# EasyEDA Pro project ProPrj_ESP32S2-Mini卡林巴17键音乐键盘_2025-05-19.epro

# Schematic Schematic2
Create Date: 2024-06-29; Page Name: P1; Project Name: 卡林巴17键模拟器; Schematic Name: Schematic2; Update Date: 2024-06-29
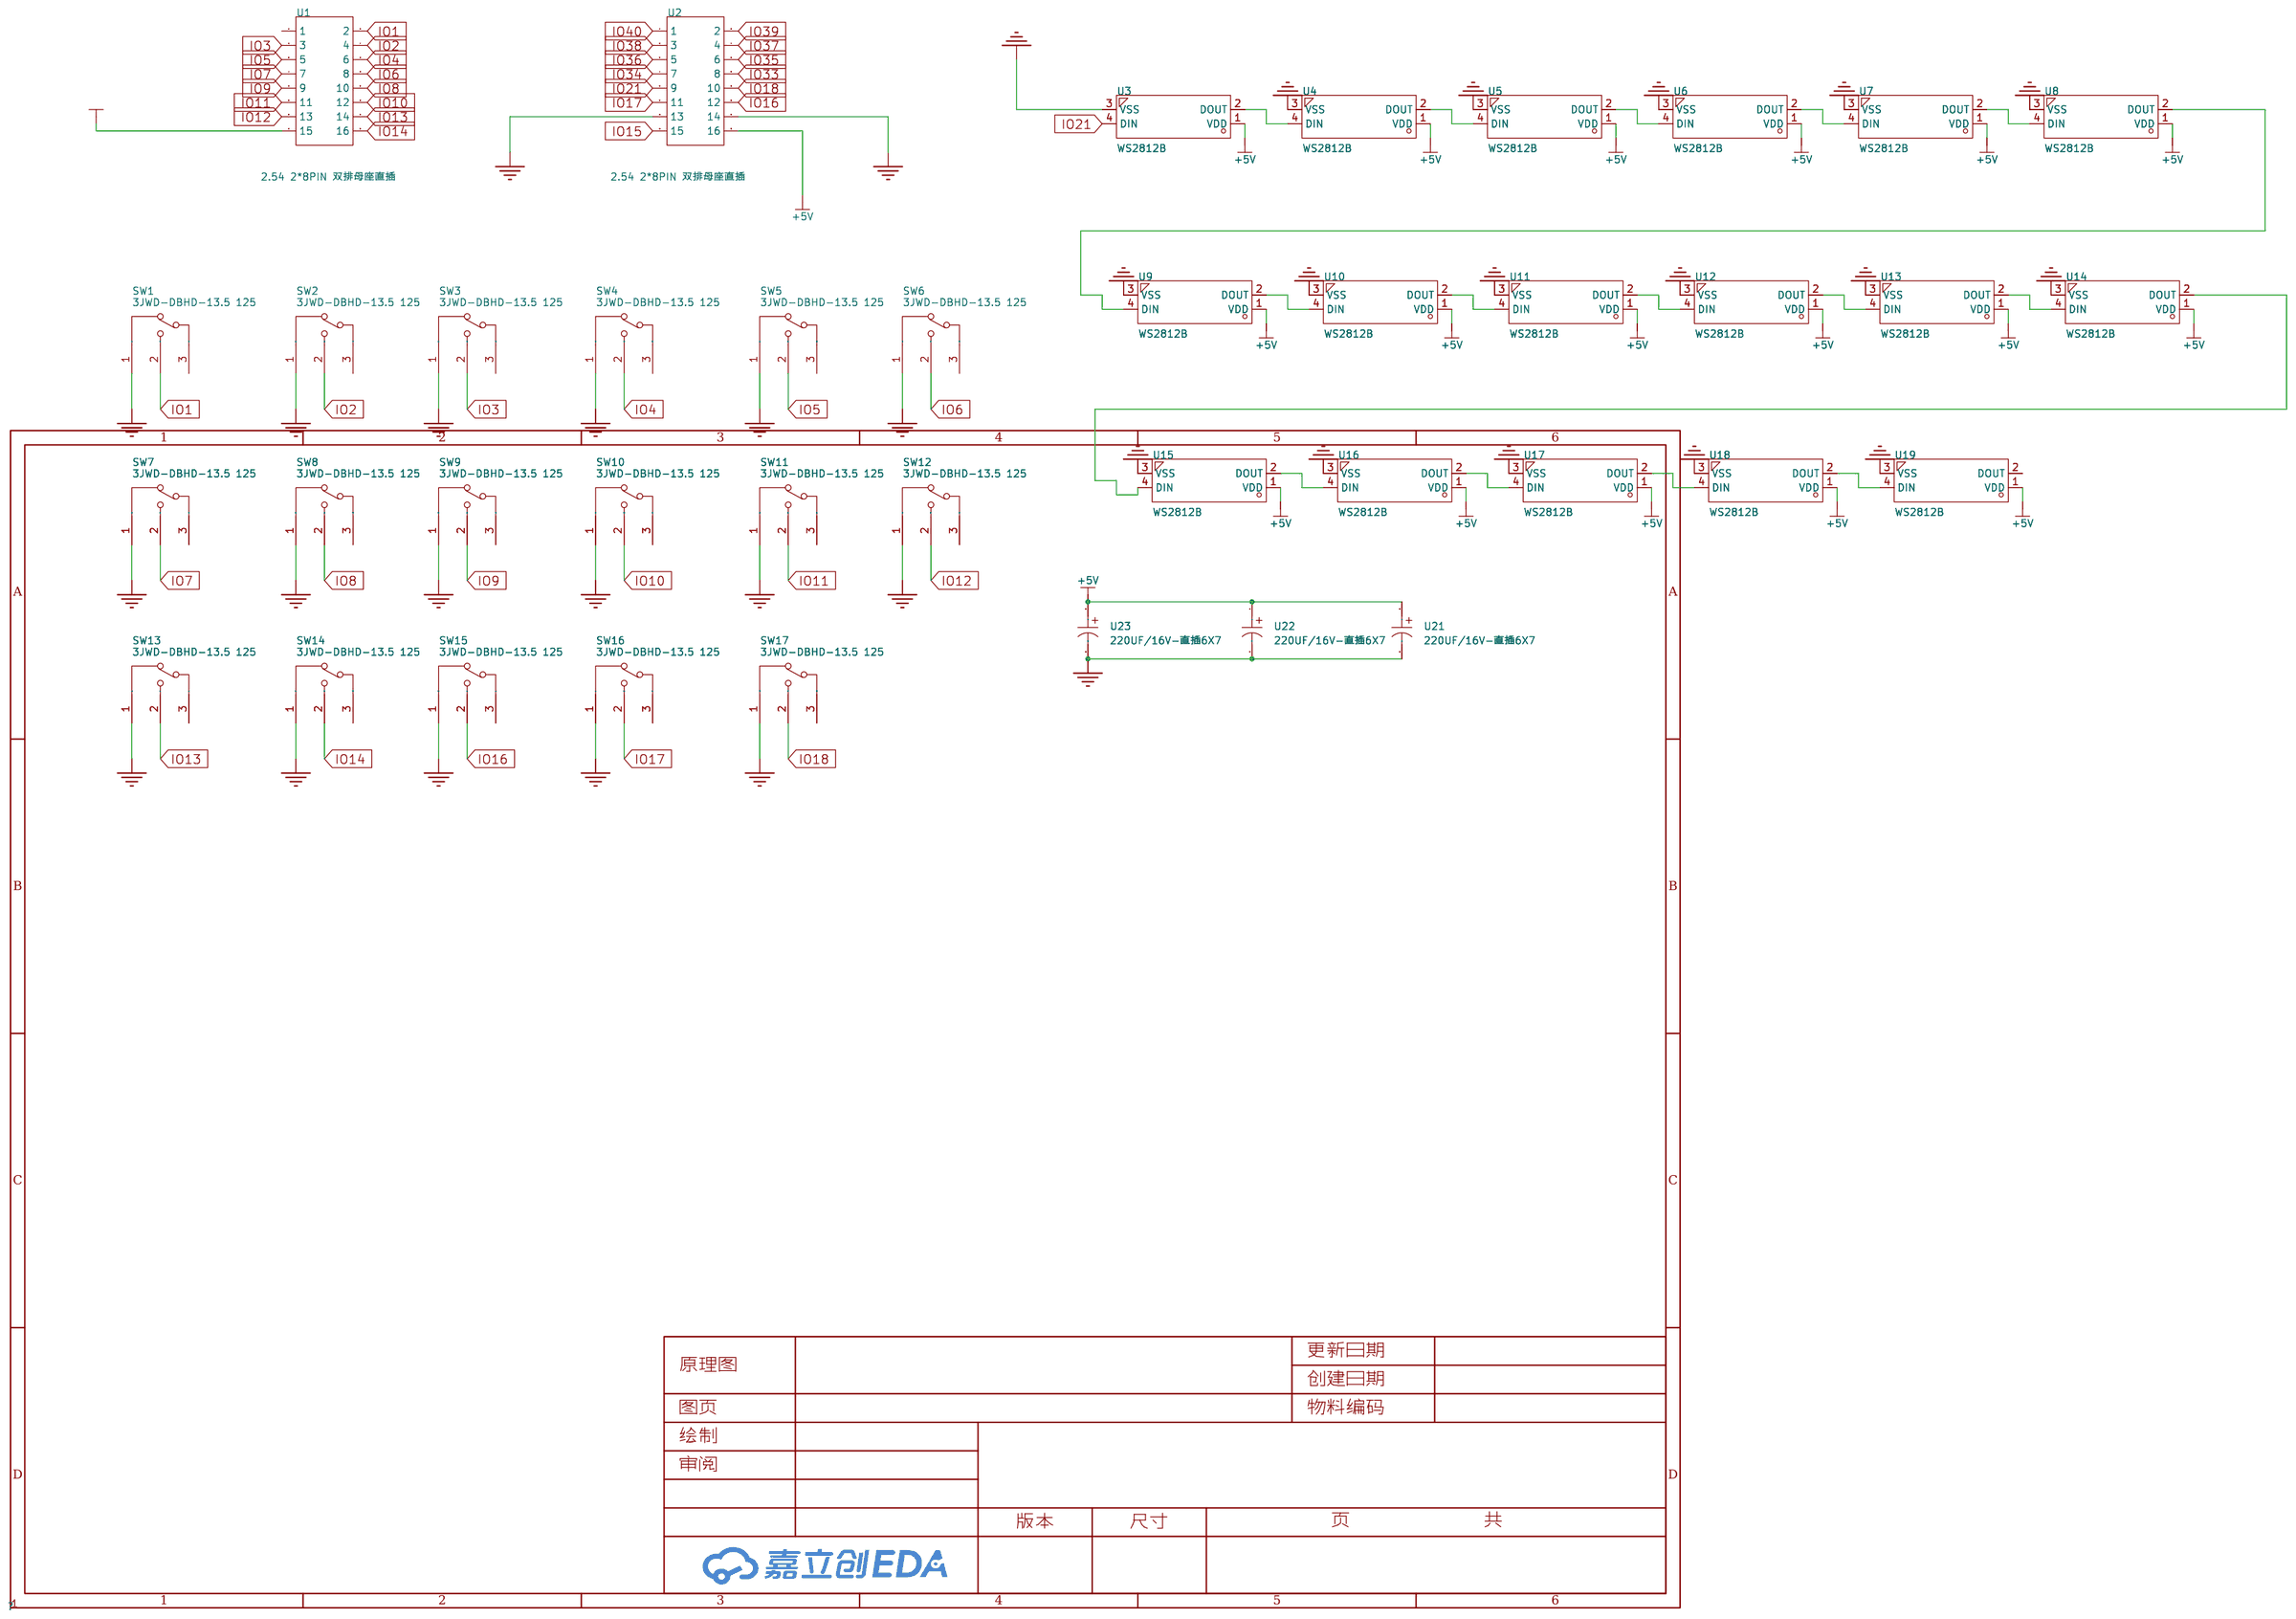
[diagram p0: schematic sheet]

## Parts
SW1  3JWD-DBHD-13.5 125  [SW-TH_SHOU-HAN_3JWD-DBHD-13.5]
SW2  3JWD-DBHD-13.5 125  [SW-TH_SHOU-HAN_3JWD-DBHD-13.5]
SW3  3JWD-DBHD-13.5 125  [SW-TH_SHOU-HAN_3JWD-DBHD-13.5]
SW4  3JWD-DBHD-13.5 125  [SW-TH_SHOU-HAN_3JWD-DBHD-13.5]
SW5  3JWD-DBHD-13.5 125  [SW-TH_SHOU-HAN_3JWD-DBHD-13.5]
SW6  3JWD-DBHD-13.5 125  [SW-TH_SHOU-HAN_3JWD-DBHD-13.5]
SW7  3JWD-DBHD-13.5 125  [SW-TH_SHOU-HAN_3JWD-DBHD-13.5]
SW8  3JWD-DBHD-13.5 125  [SW-TH_SHOU-HAN_3JWD-DBHD-13.5]
SW9  3JWD-DBHD-13.5 125  [SW-TH_SHOU-HAN_3JWD-DBHD-13.5]
SW10  3JWD-DBHD-13.5 125  [SW-TH_SHOU-HAN_3JWD-DBHD-13.5]
SW11  3JWD-DBHD-13.5 125  [SW-TH_SHOU-HAN_3JWD-DBHD-13.5]
SW12  3JWD-DBHD-13.5 125  [SW-TH_SHOU-HAN_3JWD-DBHD-13.5]
SW13  3JWD-DBHD-13.5 125  [SW-TH_SHOU-HAN_3JWD-DBHD-13.5]
SW14  3JWD-DBHD-13.5 125  [SW-TH_SHOU-HAN_3JWD-DBHD-13.5]
SW15  3JWD-DBHD-13.5 125  [SW-TH_SHOU-HAN_3JWD-DBHD-13.5]
SW16  3JWD-DBHD-13.5 125  [SW-TH_SHOU-HAN_3JWD-DBHD-13.5]
SW17  3JWD-DBHD-13.5 125  [SW-TH_SHOU-HAN_3JWD-DBHD-13.5]
U1  2.54 2*8PIN 双排母座直插  [HDR-TH_16P-P2.54-V-F-R2-C8-S2.54-1]
U2  2.54 2*8PIN 双排母座直插  [HDR-TH_16P-P2.54-V-F-R2-C8-S2.54-1]
U3  WS2812B  [LED-SMD_4P-L5.0-W5.0-TL]
U4  WS2812B  [LED-SMD_4P-L5.0-W5.0-TL]
U5  WS2812B  [LED-SMD_4P-L5.0-W5.0-TL]
U6  WS2812B  [LED-SMD_4P-L5.0-W5.0-TL]
U7  WS2812B  [LED-SMD_4P-L5.0-W5.0-TL]
U8  WS2812B  [LED-SMD_4P-L5.0-W5.0-TL]
U9  WS2812B  [LED-SMD_4P-L5.0-W5.0-TL]
U10  WS2812B  [LED-SMD_4P-L5.0-W5.0-TL]
U11  WS2812B  [LED-SMD_4P-L5.0-W5.0-TL]
U12  WS2812B  [LED-SMD_4P-L5.0-W5.0-TL]
U13  WS2812B  [LED-SMD_4P-L5.0-W5.0-TL]
U14  WS2812B  [LED-SMD_4P-L5.0-W5.0-TL]
U15  WS2812B  [LED-SMD_4P-L5.0-W5.0-TL]
U16  WS2812B  [LED-SMD_4P-L5.0-W5.0-TL]
U17  WS2812B  [LED-SMD_4P-L5.0-W5.0-TL]
U18  WS2812B  [LED-SMD_4P-L5.0-W5.0-TL]
U19  WS2812B  [LED-SMD_4P-L5.0-W5.0-TL]
U21  220UF/16V-直插6X7  [CAP-TH_BD6.3-P2.50-D0.5-FD]
U22  220UF/16V-直插6X7  [CAP-TH_BD6.3-P2.50-D0.5-FD]
U23  220UF/16V-直插6X7  [CAP-TH_BD6.3-P2.50-D0.5-FD]

## Library data of the parts
SW1-SW17 = 3JWD-DBHD-13.5 125: 鼠标开关 3脚微动开关 红点 柄长13.5mm; LCSC Part Name: 3脚鼠标ETC专用微动开关 1A 125V 带柄柄长13.5mm 红点; Supplier Part: C2906291; Manufacturer: SHOU HAN(首韩); Supplier Footprint: 插件; JLCPCB Part Class: 扩展库; Datasheet: https://atta.szlcsc.com/upload/public/pdf/source/20211019/52ACE125E0FDD69DD4046775F52831F0.pdf; Supplier: LCSC
U1 U2 = 2.54 2*8PIN 双排母座直插: Supplier Part: C9900000696; Supplier Footprint: TH-16_5.0X20.3X2.54P; JLCPCB Part Class: 扩展库; Supplier: LCSC
U3-U19 = WS2812B_1: Supplier Part: C9900106807; Supplier Footprint: SMD-LED-5328; JLCPCB Part Class: 扩展库; Supplier: LCSC
U21-U23 = 220UF/16V-直插6X7: Supplier Part: C9900012263; Supplier Footprint: CAP-TH; JLCPCB Part Class: 扩展库; Supplier: LCSC

## Nets
+5V: U2.16 U3.1(VDD) U4.1(VDD) U5.1(VDD) U6.1(VDD) U7.1(VDD) U8.1(VDD) U9.1(VDD) U10.1(VDD) U11.1(VDD) U12.1(VDD) U13.1(VDD) U14.1(VDD) U15.1(VDD) U16.1(VDD) U17.1(VDD) U18.1(VDD) U19.1(VDD) U21.1 U22.1 U23.1
GND: SW1.1(C) SW2.1(C) SW3.1(C) SW4.1(C) SW5.1(C) SW6.1(C) SW7.1(C) SW8.1(C) SW9.1(C) SW10.1(C) SW11.1(C) SW12.1(C) SW13.1(C) SW14.1(C) SW15.1(C) SW16.1(C) SW17.1(C) U2.13 U2.14 U3.3(VSS) U4.3(VSS) U5.3(VSS) U6.3(VSS) U7.3(VSS) U8.3(VSS) U9.3(VSS) U10.3(VSS) U11.3(VSS) U12.3(VSS) U13.3(VSS) U14.3(VSS) U15.3(VSS) U16.3(VSS) U17.3(VSS) U18.3(VSS) U19.3(VSS) U21.2 U22.2 U23.2
VCC3v3: U1.15
IO1: SW1.2(ON) U1.2
IO2: SW2.2(ON) U1.4
IO3: SW3.2(ON) U1.3
IO4: SW4.2(ON) U1.6
IO5: SW5.2(ON) U1.5
IO6: SW6.2(ON) U1.8
IO7: SW7.2(ON) U1.7
IO8: SW8.2(ON) U1.10
IO9: SW9.2(ON) U1.9
IO10: SW10.2(ON) U1.12
IO11: SW11.2(ON) U1.11
IO12: SW12.2(ON) U1.13
IO13: SW13.2(ON) U1.14
IO14: SW14.2(ON) U1.16
IO15: U2.15
IO16: SW15.2(ON) U2.12
IO17: SW16.2(ON) U2.11
IO18: SW17.2(ON) U2.10
IO21: U2.9 U3.4(DIN)
IO33: U2.8
IO34: U2.7
IO35: U2.6
IO36: U2.5
IO37: U2.4
IO38: U2.3
IO39: U2.2
IO40: U2.1
$1N2620: U3.2(DOUT) U4.4(DIN)
$1N2777: U4.2(DOUT) U5.4(DIN)
$1N2848: U5.2(DOUT) U6.4(DIN)
$1N2919: U6.2(DOUT) U7.4(DIN)
$1N2990: U7.2(DOUT) U8.4(DIN)
$1N3061: U8.2(DOUT) U9.4(DIN)
$1N3132: U9.2(DOUT) U10.4(DIN)
$1N3203: U10.2(DOUT) U11.4(DIN)
$1N3274: U11.2(DOUT) U12.4(DIN)
$1N3345: U12.2(DOUT) U13.4(DIN)
$1N3416: U13.2(DOUT) U14.4(DIN)
$1N3487: U14.2(DOUT) U15.4(DIN)
$1N3558: U15.2(DOUT) U16.4(DIN)
$1N3629: U16.2(DOUT) U17.4(DIN)
$1N3700: U17.2(DOUT) U18.4(DIN)
$1N3771: U18.2(DOUT) U19.4(DIN)

Not connected (* = marked no-connect by the designer): SW1 3(NC); SW2 3(NC); SW3 3(NC); SW4 3(NC); SW5 3(NC); SW6 3(NC); SW7 3(NC); SW8 3(NC); SW9 3(NC); SW10 3(NC); SW11 3(NC); SW12 3(NC); SW13 3(NC); SW14 3(NC); SW15 3(NC); SW16 3(NC); SW17 3(NC); U1 1; U19 2(DOUT)

# Board PCB6
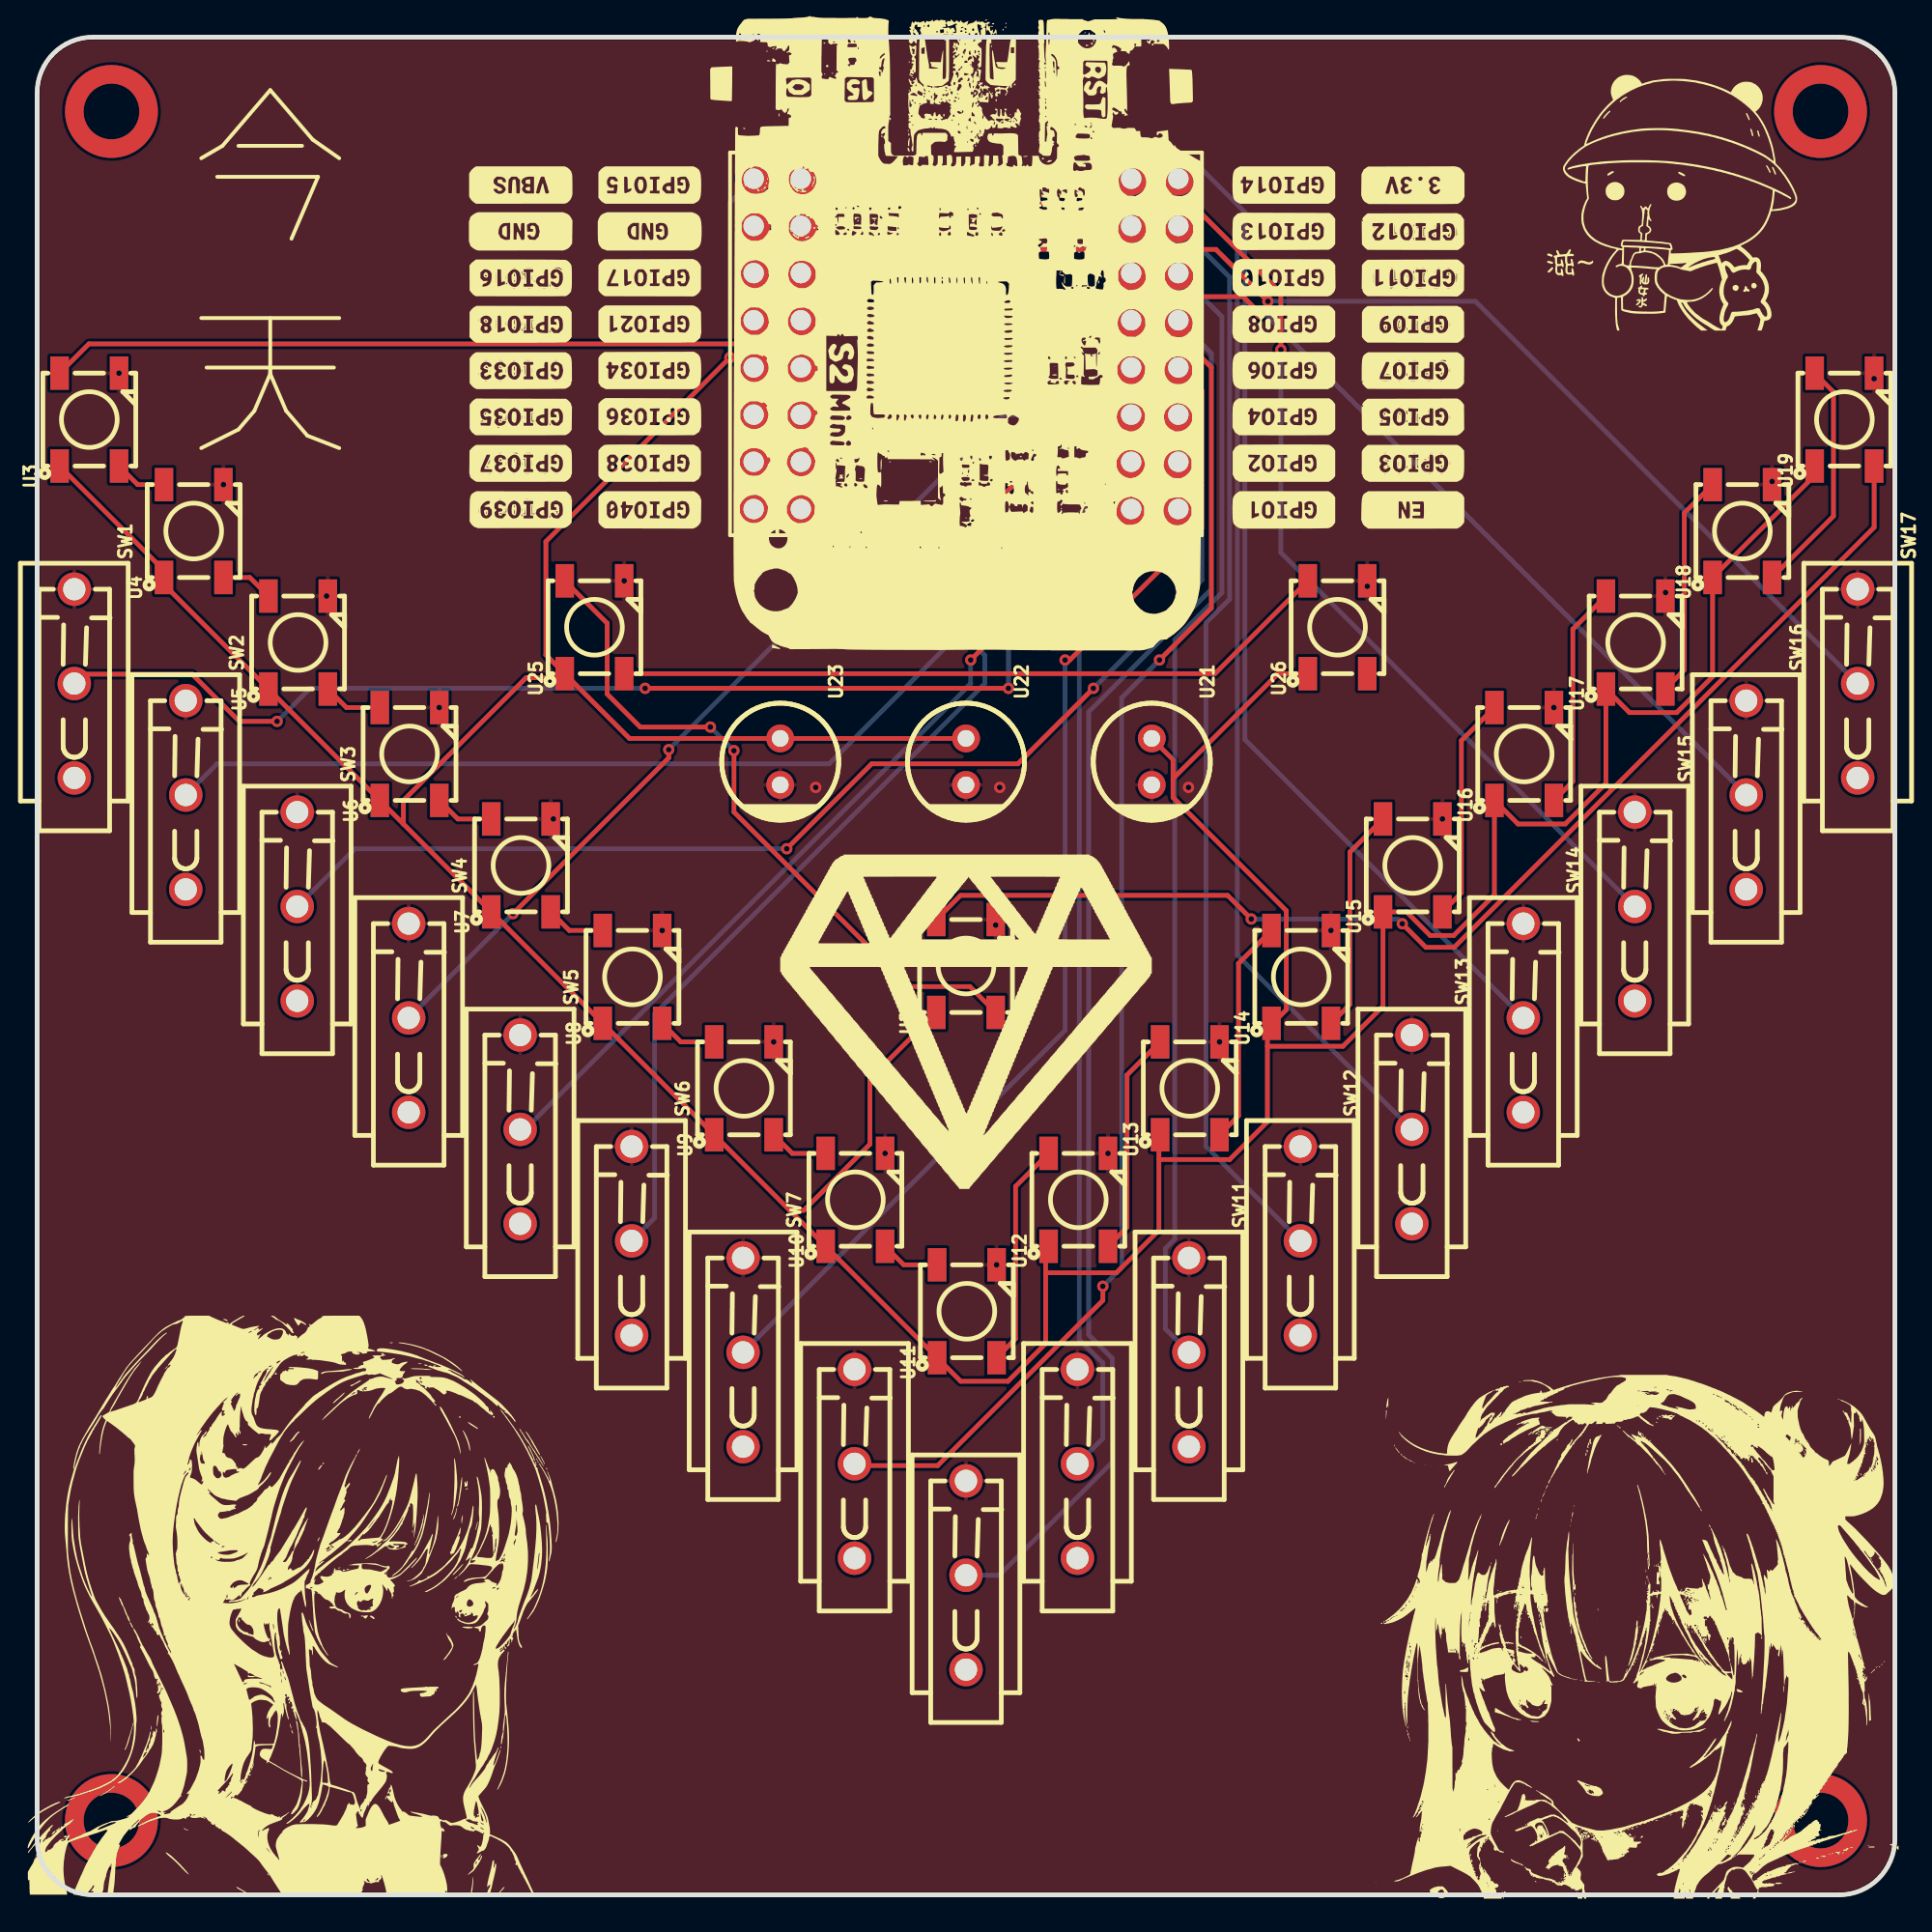
[diagram p1: board, top side]
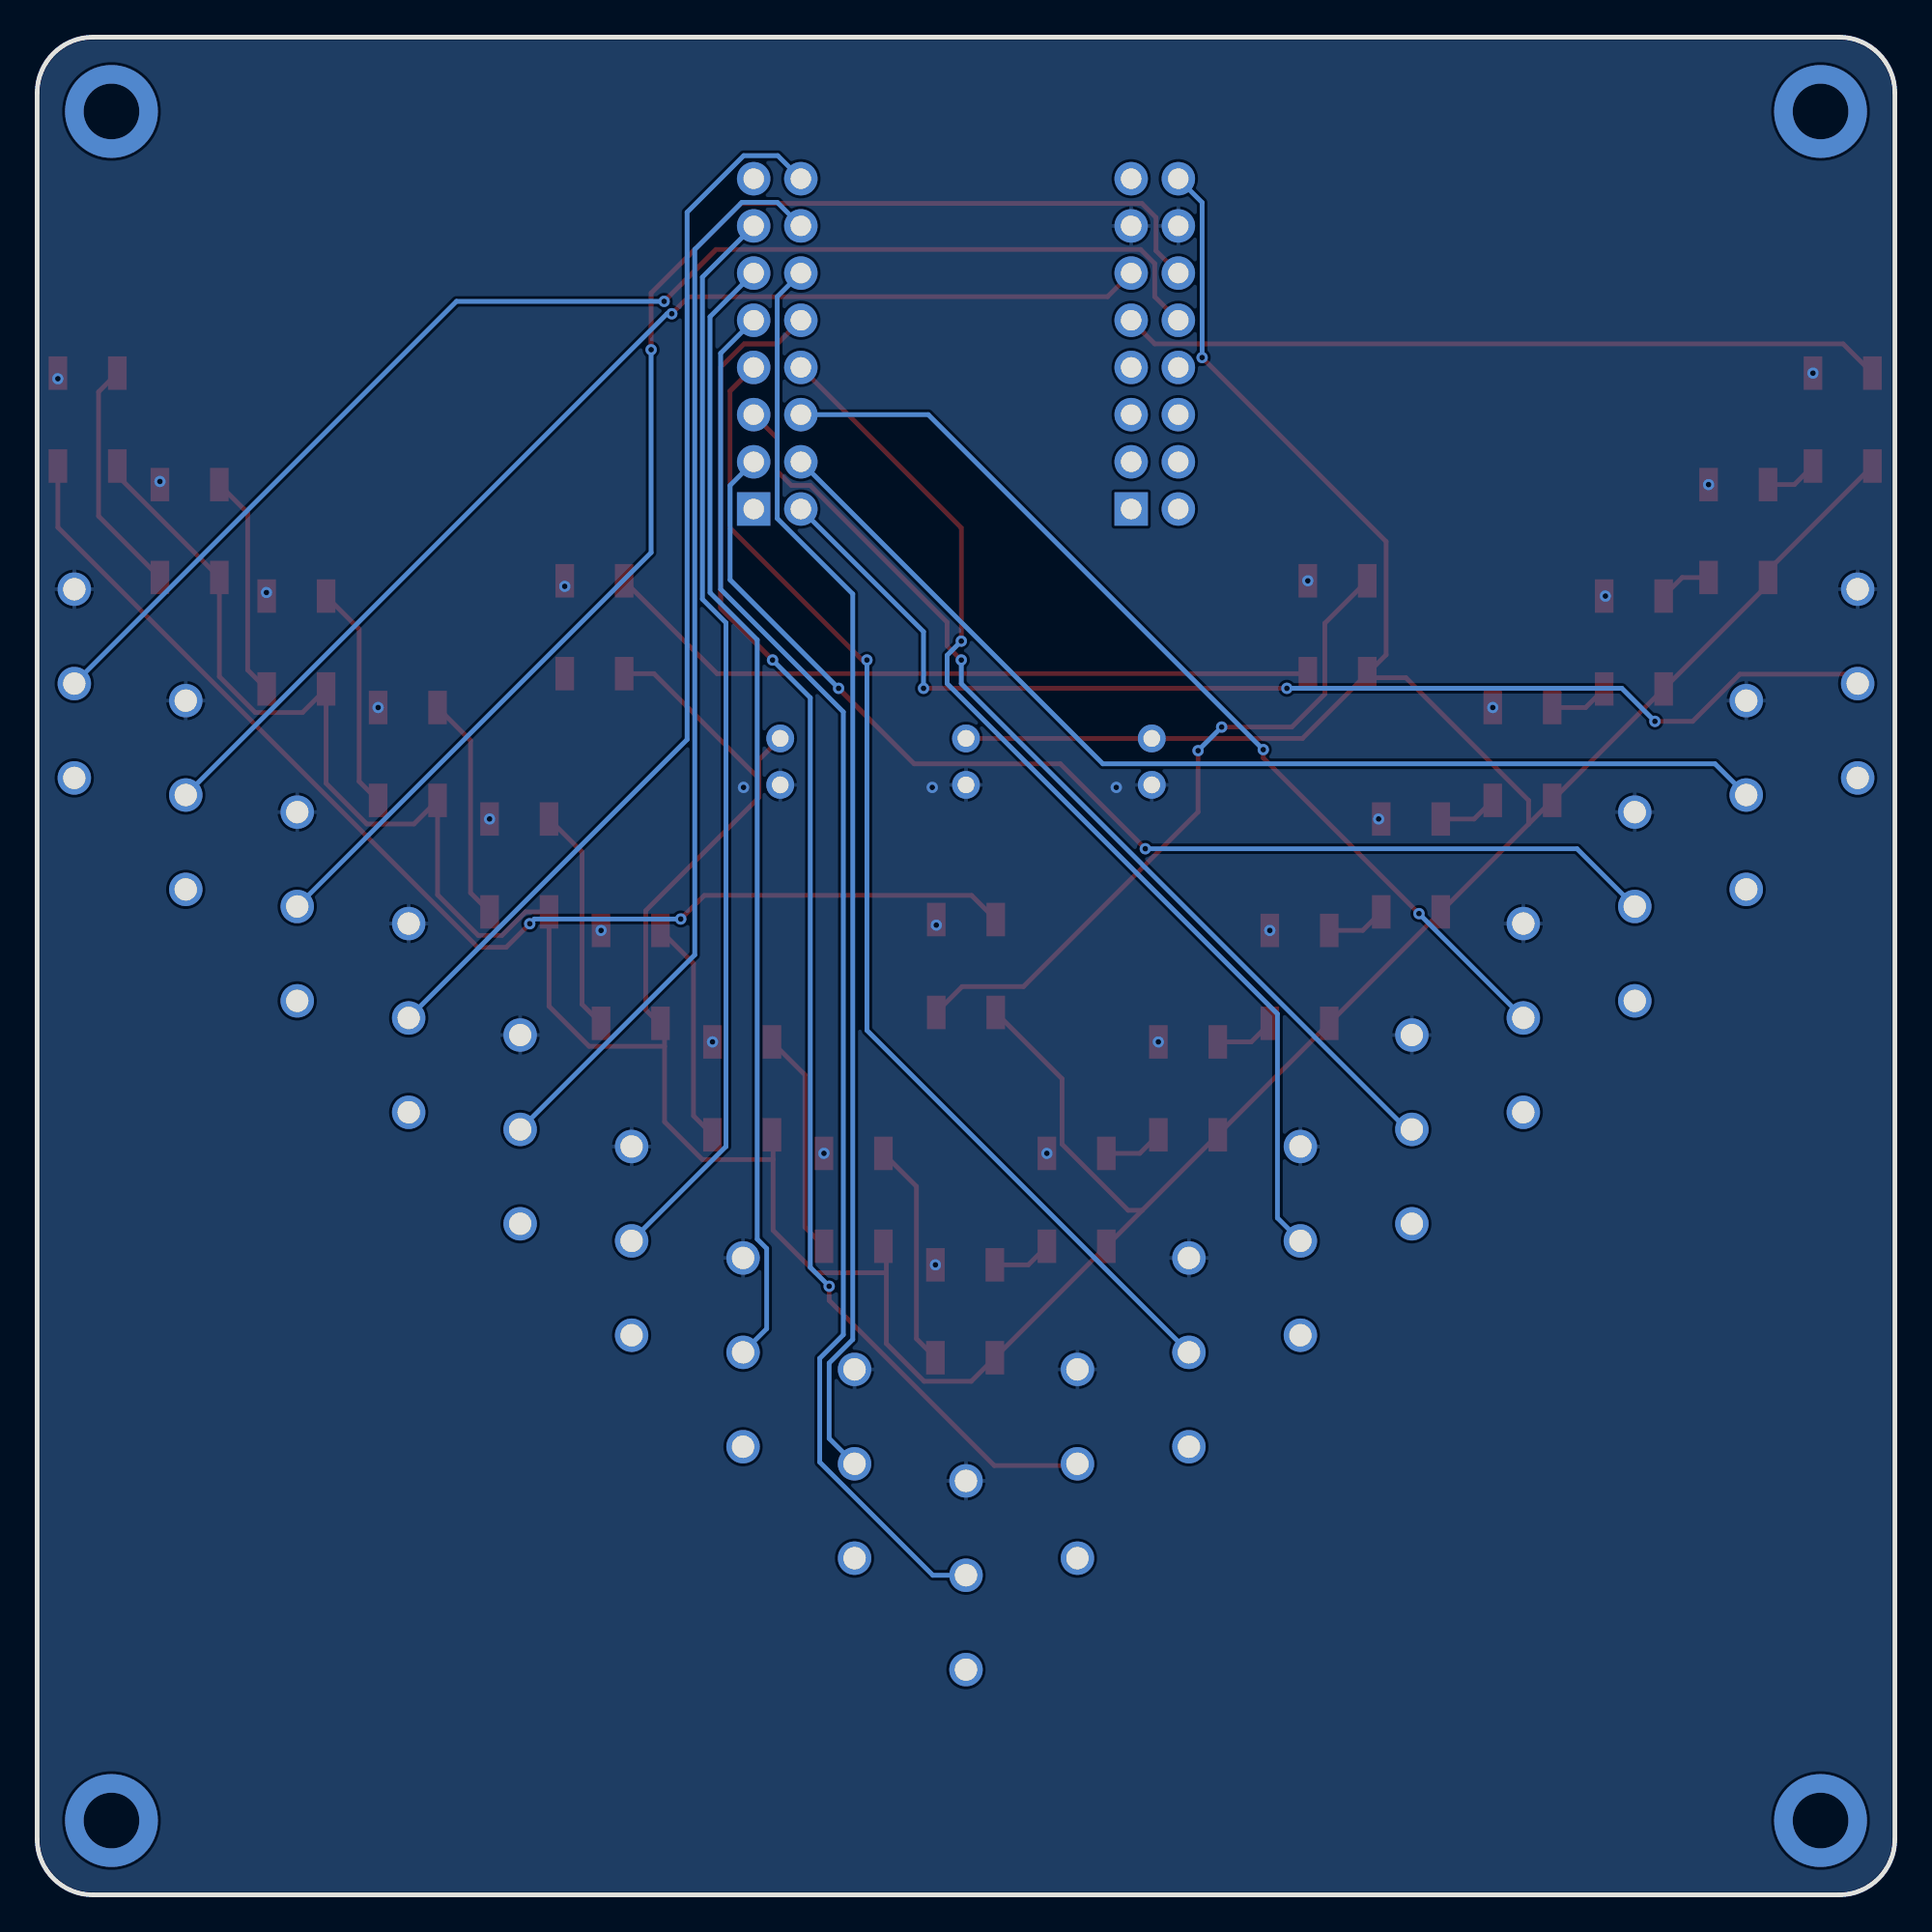
[diagram p2: board, bottom side, seen from below]

Outline 100 x 100 mm; copper layers: Top Layer, Bottom Layer. Coordinates in mm from the lower left corner of the outline.
Outline path: 0,97 0,3 arc(0.88,0.88) 3,0 97,0 arc(99.12,0.88) 100,3 100,97 arc(99.12,99.12) 97,100 3,100 arc(0.88,99.12) 0,97
Stack: Top Layer 0.035mm / Dielectric1 1.51mm FR4 er 4.5 / Bottom Layer 0.035mm

## Design rules (mm)
template: 自定义配置
spacing copperThickness1oz (default): track to track 0.102, other pairs 0.152 to 0.3
spacing copperThickness2oz: track to track 0.203, other pairs 0.152 to 0.3
track width copperThickness1oz (default): min 0.127, default 0.254, max 2.54
track width copperThickness2oz: min 0.203, default 0.254, max 2.54
differential pair differentialPair (default): width min 0.127, default 0.254, max 2.54; gap min 0.152, default 0.152
via viaSize (default): diameter min 0.5, default 0.61, max 10; hole min 0.3, default 0.305, max 6.3

## Placement (name value [footprint] x y rotation side)
SW1  3JWD-DBHD-13.5 125  [SW-TH_SHOU-HAN_3JWD-DBHD-13.5]  2 65.2 270 top
SW2  3JWD-DBHD-13.5 125  [SW-TH_SHOU-HAN_3JWD-DBHD-13.5]  8 59.2 270 top
SW3  3JWD-DBHD-13.5 125  [SW-TH_SHOU-HAN_3JWD-DBHD-13.5]  14 53.2 270 top
SW4  3JWD-DBHD-13.5 125  [SW-TH_SHOU-HAN_3JWD-DBHD-13.5]  20 47.2 270 top
SW5  3JWD-DBHD-13.5 125  [SW-TH_SHOU-HAN_3JWD-DBHD-13.5]  26 41.2 270 top
SW6  3JWD-DBHD-13.5 125  [SW-TH_SHOU-HAN_3JWD-DBHD-13.5]  32 35.2 270 top
SW7  3JWD-DBHD-13.5 125  [SW-TH_SHOU-HAN_3JWD-DBHD-13.5]  38 29.2 270 top
SW8  3JWD-DBHD-13.5 125  [SW-TH_SHOU-HAN_3JWD-DBHD-13.5]  44 23.2 270 top
SW9  3JWD-DBHD-13.5 125  [SW-TH_SHOU-HAN_3JWD-DBHD-13.5]  50 17.2 270 top
SW10  3JWD-DBHD-13.5 125  [SW-TH_SHOU-HAN_3JWD-DBHD-13.5]  56 23.2 270 top
SW11  3JWD-DBHD-13.5 125  [SW-TH_SHOU-HAN_3JWD-DBHD-13.5]  62 29.2 270 top
SW12  3JWD-DBHD-13.5 125  [SW-TH_SHOU-HAN_3JWD-DBHD-13.5]  68 35.2 270 top
SW13  3JWD-DBHD-13.5 125  [SW-TH_SHOU-HAN_3JWD-DBHD-13.5]  74 41.2 270 top
SW14  3JWD-DBHD-13.5 125  [SW-TH_SHOU-HAN_3JWD-DBHD-13.5]  80 47.2 270 top
SW15  3JWD-DBHD-13.5 125  [SW-TH_SHOU-HAN_3JWD-DBHD-13.5]  86 53.2 270 top
SW16  3JWD-DBHD-13.5 125  [SW-TH_SHOU-HAN_3JWD-DBHD-13.5]  92 59.2 270 top
SW17  3JWD-DBHD-13.5 125  [SW-TH_SHOU-HAN_3JWD-DBHD-13.5]  98 65.2 270 top
U1  2.54 2*8PIN 双排母座直插  [HDR-TH_16P-P2.54-V-F-R2-C8-S2.54-1]  60.16 83.49 90 top
U2  2.54 2*8PIN 双排母座直插  [HDR-TH_16P-P2.54-V-F-R2-C8-S2.54-1]  39.84 83.49 90 top
U3  WS2812B  [LED-SMD_4P-L5.0-W5.0-TL]  2.81 79.41 90 top
U4  WS2812B  [LED-SMD_4P-L5.0-W5.0-TL]  8.43 73.41 90 top
U5  WS2812B  [LED-SMD_4P-L5.0-W5.0-TL]  14.05 67.41 90 top
U6  WS2812B  [LED-SMD_4P-L5.0-W5.0-TL]  20.05 61.41 90 top
U7  WS2812B  [LED-SMD_4P-L5.0-W5.0-TL]  26.05 55.41 90 top
U8  WS2812B  [LED-SMD_4P-L5.0-W5.0-TL]  32.05 49.41 90 top
U9  WS2812B  [LED-SMD_4P-L5.0-W5.0-TL]  38.05 43.41 90 top
U10  WS2812B  [LED-SMD_4P-L5.0-W5.0-TL]  44.05 37.41 90 top
U11  WS2812B  [LED-SMD_4P-L5.0-W5.0-TL]  50.05 31.41 90 top
U12  WS2812B  [LED-SMD_4P-L5.0-W5.0-TL]  56.05 37.41 90 top
U13  WS2812B  [LED-SMD_4P-L5.0-W5.0-TL]  62.05 43.41 90 top
U14  WS2812B  [LED-SMD_4P-L5.0-W5.0-TL]  68.05 49.41 90 top
U15  WS2812B  [LED-SMD_4P-L5.0-W5.0-TL]  74.05 55.41 90 top
U16  WS2812B  [LED-SMD_4P-L5.0-W5.0-TL]  80.05 61.41 90 top
U17  WS2812B  [LED-SMD_4P-L5.0-W5.0-TL]  86.05 67.41 90 top
U18  WS2812B  [LED-SMD_4P-L5.0-W5.0-TL]  91.79 73.41 90 top
U19  WS2812B  [LED-SMD_4P-L5.0-W5.0-TL]  97.28 79.41 90 top
U21  220UF/16V-直插6X7  [CAP-TH_BD6.3-P2.50-D0.5-FD]  60 61 270 top
U22  220UF/16V-直插6X7  [CAP-TH_BD6.3-P2.50-D0.5-FD]  50 61 270 top
U23  220UF/16V-直插6X7  [CAP-TH_BD6.3-P2.50-D0.5-FD]  40 61 270 top
U24  WS2812B  [LED-SMD_4P-L5.0-W5.0-TL]  50 50 90 top
U25  WS2812B  [LED-SMD_4P-L5.0-W5.0-TL]  30 68.24 90 top
U26  WS2812B  [LED-SMD_4P-L5.0-W5.0-TL]  70 68.24 90 top

## Footprints (pads in the part's own frame, mm; a bottom-side part is the same pattern mirrored in y, then rotated)
CAP-TH_BD6.3-P2.50-D0.5-FD
  round 1.5 hole 0.9: 1(-1.25,0) 2(1.25,0)
HDR-TH_16P-P2.54-V-F-R2-C8-S2.54-1
  rect 1.8x1.8 hole 1.1: 1(-8.89,-1.27)
  round 1.8 hole 1.1: 2(-8.89,1.27) 3(-6.35,-1.27) 4(-6.35,1.27) 5(-3.81,-1.27) 6(-3.81,1.27) 7(-1.27,-1.27) 8(-1.27,1.27) 9(1.27,-1.27) 10(1.27,1.27) 11(3.81,-1.27) 12(3.81,1.27) 13(6.35,-1.27) 14(6.35,1.27) 15(8.89,-1.27) 16(8.89,1.27)
LED-SMD_4P-L5.0-W5.0-TL
  rect 1.8x1 smd: 1(-2.5,1.6) 2(-2.5,-1.6) 3(2.5,-1.6) 4(2.5,1.6)
SW-TH_SHOU-HAN_3JWD-DBHD-13.5
  round 1.8 hole 1.2: 1(-5.08,0) 2(0,0) 3(5.08,0)

## Nets
As in the schematic, except:
+5V: U2.16 U3.1 U4.1 U5.1 U6.1 U7.1 U8.1 U9.1 U10.1 U11.1 U12.1 U13.1 U14.1 U15.1 U16.1 U17.1 U18.1 U19.1 U21.1 U22.1 U23.1 U24.1 U25.1 U26.1
GND: SW1.1 SW2.1 SW3.1 SW4.1 SW5.1 SW6.1 SW7.1 SW8.1 SW9.1 SW10.1 SW11.1 SW12.1 SW13.1 SW14.1 SW15.1 SW16.1 SW17.1 U2.13 U2.14 U3.3 U4.3 U5.3 U6.3 U7.3 U8.3 U9.3 U10.3 U11.3 U12.3 U13.3 U14.3 U15.3 U16.3 U17.3 U18.3 U19.3 U21.2 U22.2 U23.2 U24.3 U25.3 U26.3
$1N7205: U19.2 U24.4
$1N7272: U24.2 U25.4
$1N7339: U25.2 U26.4

Pads without a net: SW1 3; SW2 3; SW3 3; SW4 3; SW5 3; SW6 3; SW7 3; SW8 3; SW9 3; SW10 3; SW11 3; SW12 3; SW13 3; SW14 3; SW15 3; SW16 3; SW17 3; U1 1; U26 2

## Via types
v1: diameter 5, hole 3, Top Layer to Bottom Layer, 4 vias
v2: diameter 0.61, hole 0.305, Top Layer to Bottom Layer, 43 vias

## Routing (per net, layer and track width the routed paths; a pad name or vN(x,y) marks a point on that pad's centre or on a via; arc(x,y) is an arc through that point)
+5V: length 272.5
  Top Layer w0.254: U12.1 54.29,34.76 54.29,33.49 ; 19.72,57.64 U6.1 U5.1 6.83,70.53 U4.1 6.83,71.3 U3.1 ; 19.72,57.64 19.72,58.91 26.32,65.52 28.18,65.52 U25.1 ; 19.72,57.64 U7.1 U8.1 U9.1 40.51,36.85 ; 61.15,60.09 66.79,65.74 U26.1 ; 61.15,60.09 61.15,61.1 U21.1 ; 61.15,60.09 61.15,59.07 67.24,52.98 67.24,47.64 66.48,46.88 ; 66.48,46.88 66.48,46.69 66.23,46.44 66.23,45.68 ; 66.48,46.88 U14.1 ; v2(37.29,82.75) 27.38,72.85 27.38,66.75 U25.1 ; U19.1 95.68,76.41 U18.1 90.19,65.58 88.26,63.64 85.72,63.64 U17.1 84.45,59.83 82.26,57.64 79.72,57.64 U16.1 78.45,53.83 76.26,51.64 74.99,51.64 73.72,52.91 U15.1 72.45,47.83 70.29,45.68 66.23,45.68 ; 66.23,45.68 66.23,41.61 64.19,39.58 60.38,39.58 ; 60.38,39.58 60.38,35.77 58.1,33.49 54.29,33.49 ; 60.38,39.58 60.38,40.85 U13.1 ; 40.51,36.85 41.27,36.85 44.83,40.41 44.83,43.93 U24.1 ; 40.51,36.85 U10.1 U11.1 49.72,27.64 52.26,27.64 54.29,29.68 54.29,33.49 ; U25.1 31.89,62.25 U23.1 U22.1
  Bottom Layer w0.254: v2(37.29,82.75) 37.29,91.1 U2.16
GND:
  vias: v2(4.41,81.91) v2(10.03,75.91) v2(15.58,69.91) v2(21.65,63.91) v2(27.79,57.91) v2(31.6,70.74) v2(33.65,51.91) v2(39.65,45.91) v2(41.91,59.61) v2(45.65,39.91) v2(51.6,52.2) v2(51.65,33.91) v2(51.82,59.61) v2(57.65,39.91) v2(61.98,59.61) v2(63.65,45.91) v2(69.65,51.91) v2(71.6,70.44) v2(75.65,57.91) v2(81.65,63.91) v2(87.66,70.1) v2(93.39,76.08) v2(98.88,81.61)
(no net):
  vias: v1(4,96) v1(4,4) v1(96,96) v1(96,4)
IO1: length 64.7
  Top Layer w0.254: v2(12.92,63.17) 10.88,63.17 8.34,65.71 2.51,65.71 SW1.2 ; v2(52.29,64.95) v2(32.73,64.95)
  Bottom Layer w0.254: v2(12.92,63.17) 14.69,64.95 v2(32.73,64.95) ; v2(52.29,64.95) 52.29,68 U1.2
IO2: length 58.3
  Bottom Layer w0.254: U1.4 42.63,60.88 9.68,60.88 SW2.2
IO3: length 62.9
  Top Layer w0.254: v2(56.86,64.95) 52.79,60.88 44.92,60.88 v2(40.35,56.31)
  Bottom Layer w0.254: U1.3 62.7,75.87 62.7,70.79 v2(56.86,64.95) ; v2(40.35,56.31) 17.11,56.31 SW3.2
IO4: length 52.6
  Top Layer w0.254: v2(34,61.65) 34,61.2 v2(25.62,52.82)
  Bottom Layer w0.254: v2(34,61.65) 52.03,79.68 U1.6 ; v2(25.62,52.82) SW4.2
IO5: length 53.9
  Top Layer w0.254: v2(50.25,66.47) 51.02,67.23 51.02,68.5 58.38,75.87 59.4,75.87 60.16,76.63 60.16,78.41 U1.5
  Bottom Layer w0.254: SW5.2 26.26,41.2 50.25,65.2 v2(50.25,66.47)
IO6: length 58.8
  Top Layer w0.254: v2(50.25,67.49) 50.25,73.58 U1.8
  Bottom Layer w0.254: SW6.2 33.24,36.44 33.24,47.42 51.02,65.2 51.02,66.73 v2(50.25,67.49)
IO7: length 63.9
  Top Layer w0.254: v2(55.33,66.47) 55.59,66.47 62.7,73.58 62.7,80.95 U1.7
  Bottom Layer w0.254: v2(55.33,66.47) 55.33,46.54 SW7.2
IO8: length 75.1
  Top Layer w0.254: v2(57.37,32.76) 57.37,32 48.48,23.11 44.1,23.11 SW8.2 ; U1.10 60.16,83.49 61.94,83.49 63.21,82.22 63.21,69.27 v2(60.41,66.47)
  Bottom Layer w0.254: v2(57.37,32.76) 58.38,33.78 58.38,64.44 v2(60.41,66.47)
IO9: length 75.9
  Bottom Layer w0.254: SW9.2 51.79,17.2 57.87,23.29 57.87,28.88 56.6,30.15 56.6,63.68 63.21,70.28 63.21,82.98 U1.9
IO10: length 67.4
  Bottom Layer w0.254: U1.12 60.16,86.03 60.16,74.09 56.1,70.03 56.1,29.9 57.37,28.63 57.37,24.57 SW10.2
IO11: length 60.9
  Bottom Layer w0.254: SW11.2 60.73,30.47 60.73,34.79 61.24,35.3 61.24,67.56 63.78,70.1 63.78,84.95 U1.11
IO12: length 58.4
  Bottom Layer w0.254: SW12.2 62.92,40.28 62.92,68.48 64.19,69.75 64.19,87.08 U1.13
IO13: length 58.5
  Bottom Layer w0.254: SW13.2 64.6,50.6 64.6,88.57 62.06,91.11 60.16,91.11 U1.14
IO14: length 57.5
  Bottom Layer w0.254: SW14.2 65.01,62.19 65.01,90.57 61.97,93.62 60.13,93.62 U1.16
IO16: length 73.9
  Top Layer w0.254: U2.12 39.77,88.5 39.77,90.29 40.53,91.05 62.12,91.05 66.95,86.22 v2(66.95,83.18)
  Bottom Layer w0.254: v2(66.95,83.18) 66.95,72.25 SW15.2
IO17: length 62.5
  Top Layer w0.254: U2.11 42.38,86.03 64.92,86.03 v2(65.84,85.11)
  Bottom Layer w0.254: v2(65.84,85.11) 66.09,85.11 SW16.2
IO18: length 71.7
  Top Layer w0.254: v2(66.25,85.78) 63.46,88.57 40.6,88.57 39.84,87.81 39.84,86.03 U2.10
  Bottom Layer w0.254: v2(66.25,85.78) 77.43,85.78 SW17.2
IO21: length 41.1
  Top Layer w0.254: U3.4 2.78,83.49 39.84,83.49 U2.9
$1N2620: length 2.8
  Top Layer w0.254: U3.2 5.41,75.91 U4.4
$1N2777: length 2.8
  Top Layer w0.254: U4.2 11.45,70.91 U5.4
$1N2848: length 3.2
  Top Layer w0.254: U6.4 16.65,63.91 U5.2
$1N2919: length 3.2
  Top Layer w0.254: U6.2 22.65,57.91 U7.4
$1N2990: length 3.2
  Top Layer w0.254: U7.2 28.65,51.91 U8.4
$1N3061: length 3.2
  Top Layer w0.254: U8.2 34.65,45.91 U9.4
$1N3132: length 3.2
  Top Layer w0.254: U9.2 40.65,39.91 U10.4
$1N3203: length 3.2
  Top Layer w0.254: U10.2 46.65,33.91 U11.4
$1N3274: length 12.2
  Top Layer w0.254: U12.4 52.67,38.14 52.67,29.94 U11.2
$1N3345: length 12.2
  Top Layer w0.254: U12.2 58.67,35.94 58.67,44.14 U13.4
$1N3416: length 12.2
  Top Layer w0.254: U14.4 64.67,50.14 64.67,41.94 U13.2
$1N3487: length 12.2
  Top Layer w0.254: U15.4 70.67,56.14 70.67,47.94 U14.2
$1N3558: length 12.2
  Top Layer w0.254: U16.4 76.67,62.14 76.67,53.94 U15.2
$1N3629: length 12.2
  Top Layer w0.254: U16.2 82.67,59.94 82.67,68.14 U17.4
$1N3700: length 12.1
  Top Layer w0.254: U17.2 88.67,65.94 88.67,74.39 U18.4
$1N3771: length 12.8
  Top Layer w0.254: U19.4 96.69,80.9 96.69,74.22 U18.2
$1N7205: length 64.8
  Top Layer w0.254: U19.2 98.88,73.61 76.28,51.01 74.75,51.01 v2(73.48,52.28) ; U24.4 49.7,53.8 64.09,53.8 v2(65.36,52.53)
  Bottom Layer w0.254: v2(65.36,52.53) 73.23,52.53 v2(73.48,52.28)
$1N7272: length 37
  Top Layer w0.254: v2(36.24,62.86) 32.46,62.86 30.69,64.64 30.69,68.45 U25.4 ; v2(37.51,61.59) 37.51,58.29 46.91,48.89 50.21,48.89 U24.2
  Bottom Layer w0.254: v2(36.24,62.86) v2(37.51,61.59)
$1N7339: length 38.9
  Top Layer w0.254: U26.4 63.4,65.74 U25.2

## Copper pours and planes (outline as drawn; the poured copper is in the pictures)
GND on Top Layer: 0,100 100,100 100,0 0,0
GND on Bottom Layer: 0,100 100,100 100,0 0,0

## Text on the board
Top Silkscreen Layer: 今 / 天
